# Altium schematic sheet DSO_IO.SchDoc: Schematic_Name
size A4; CompanyName: University of Melbourne; Engineer: Your Name Here; DocumentNumber: 1; Revision: 0.1; SheetNumber: 1; SheetTotal: 1; Title_Project: Project_Title; StudentNo: Student No.
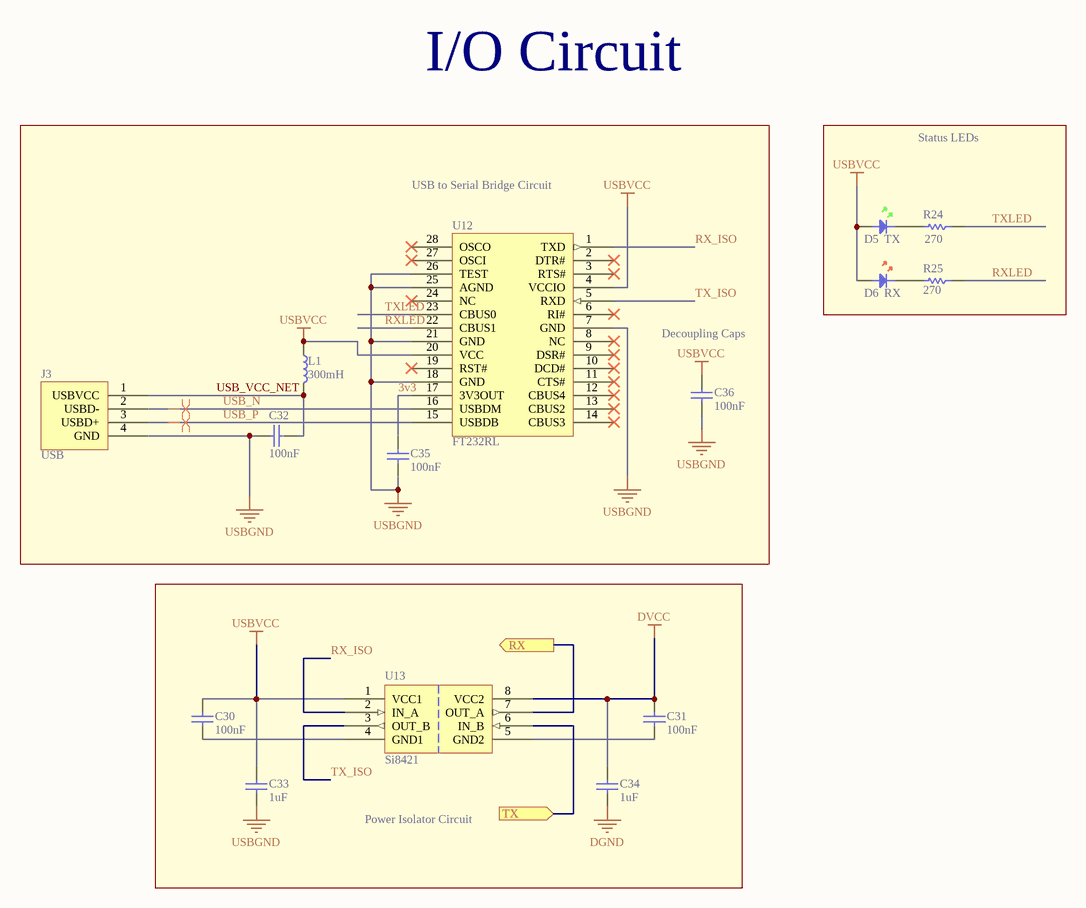
[diagram p0: DSO_IO.SchDoc]

## Parts
C30  100nF  [0805C]
C31  100nF  [0805C]
C32  100nF  [0805C]
C33  1uF  [0805C]
C34  1uF  [0805C]
C35  100nF  [0805C]
C36  100nF  [0805C]
D5  TX  [0805D-GREEN]
D6  RX  [0805D-RED]
J3  USB  [USBPLUG]
L1  300mH  [0805]
R24  270  [0805]
R25  270  [0805]
U12  FT232RL  [SSOP-28]
U13  Si8421  [SOIC-8]

## Blocks framed on the sheet
Status LEDs: D5 D6 R24 R25
Power Isolator Circuit: C30 C31 C33 C34 U13

## Ports
RX (out), TX (in)

## Nets
DGND: C34.1
DVCC: C31.1 C34.2 U13.8(VCC2)
USBGND: C32.2 C33.2 C35.2 C36.2 J3.4(GND) U12.7(GND) U12.18(GND) U12.21(GND) U12.25(AGND) U12.26(TEST)
USBVCC: C30.1 C33.1 C36.1 D5.A D6.A L1.1 U12.4(VCCIO) U12.20(VCC) U13.1(VCC1)
3v3: C35.1 U12.17(3V3OUT)
RX: U13.7(OUT_A) ; port RX
RX_ISO: U12.1(TXD) U13.2(IN_A)
RXLED: R25.1 U12.22(CBUS1)
TX: U13.6(IN_B) ; port TX
TX_ISO: U12.5(RXD) U13.3(OUT_B)
TXLED: R24.1 U12.23(CBUS0)
USB_N: J3.2(USBD-) U12.16(USBDM)
USB_P: J3.3(USBD+) U12.15(USBDB)
USB_VCC_NET: C32.1 J3.1(USBVCC) L1.2
NetC30_2: C30.2 U13.4(GND1)
NetC31_2: C31.2 U13.5(GND2)
NetD5_K: D5.K R24.2
NetD6_K: D6.K R25.2

Not connected (* = marked no-connect by the designer): U12 2(DTR#)* 3(RTS#)* 6(RI#)* 8(NC)* 9(DSR#)* 10(DCD#)* 11(CTS#)* 12(CBUS4)* 13(CBUS2)* 14(CBUS3)* 19(RST#)* 24(NC)* 27(OSCI)* 28(OSCO)*

## Layout directives
differential pair: USB_N, USB_P

## Notes on the sheet
- I/O Circuit
- USB to Serial Bridge Circuit
- (near C36) Decoupling Caps

## Library data of the parts
C30-C36 = C: Capacitor; Reviewed by: RM - 2018/08/05; Revision: July-2002: Re-released for DXP Platform.; Supplier 1: *; Supplier Part Number 1: *
  C30-C32 C35 C36: Value: 100nF
  C33 C34: Value: 1uF
D5 = LED GREEN: Light Emitting Diode; Reviewed by: RM - 2018/08/05; Revision: July-2002: Re-released for DXP Platform.; Supplier 1: Digi-Key; Supplier Part Number 1: 160-1423-1-ND
D6 = LED RED: Light Emitting Diode; Reviewed by: RM - 2018/08/05; Revision: July-2002: Re-released for DXP Platform.; Supplier 1: Digi-Key; Supplier Part Number 1: 475-1415-1-ND
J3 = USBPLUG: USB B Type Connector; Reviewed by: RM - 2018/08/05; Supplier 1: Digi-Key; Supplier Part Number 1: 609-1039-ND
L1 = I: Inductor; Reviewed by: RM - 2018/08/05; Value: 300mH; Supplier 1: *; Supplier Part Number 1: *
R24 R25 = R: Resistor; Reviewed by: RM - 2018/08/05; Value: 270; Supplier 1: *; Suppler Part Number 1: *
U12 = FT232RL: USB to Serial bridge; Reviewed by: RM - 2018/08/05; Supplier 1: Digi-Key; Supplier Part Number 1: 768-1007-1-ND
U13 = Si8421: Dual Channel Digital Isolator Both Ways; Reviewed by: RM - 2018/08/05; Supplier 1: Digi-Key; Supplier Part Number 1: 336-1755-5-ND